# Altium schematic sheet Smart_Lighting_System_P1.SchDoc
size A; SheetNumber: 2; SheetTotal: 2
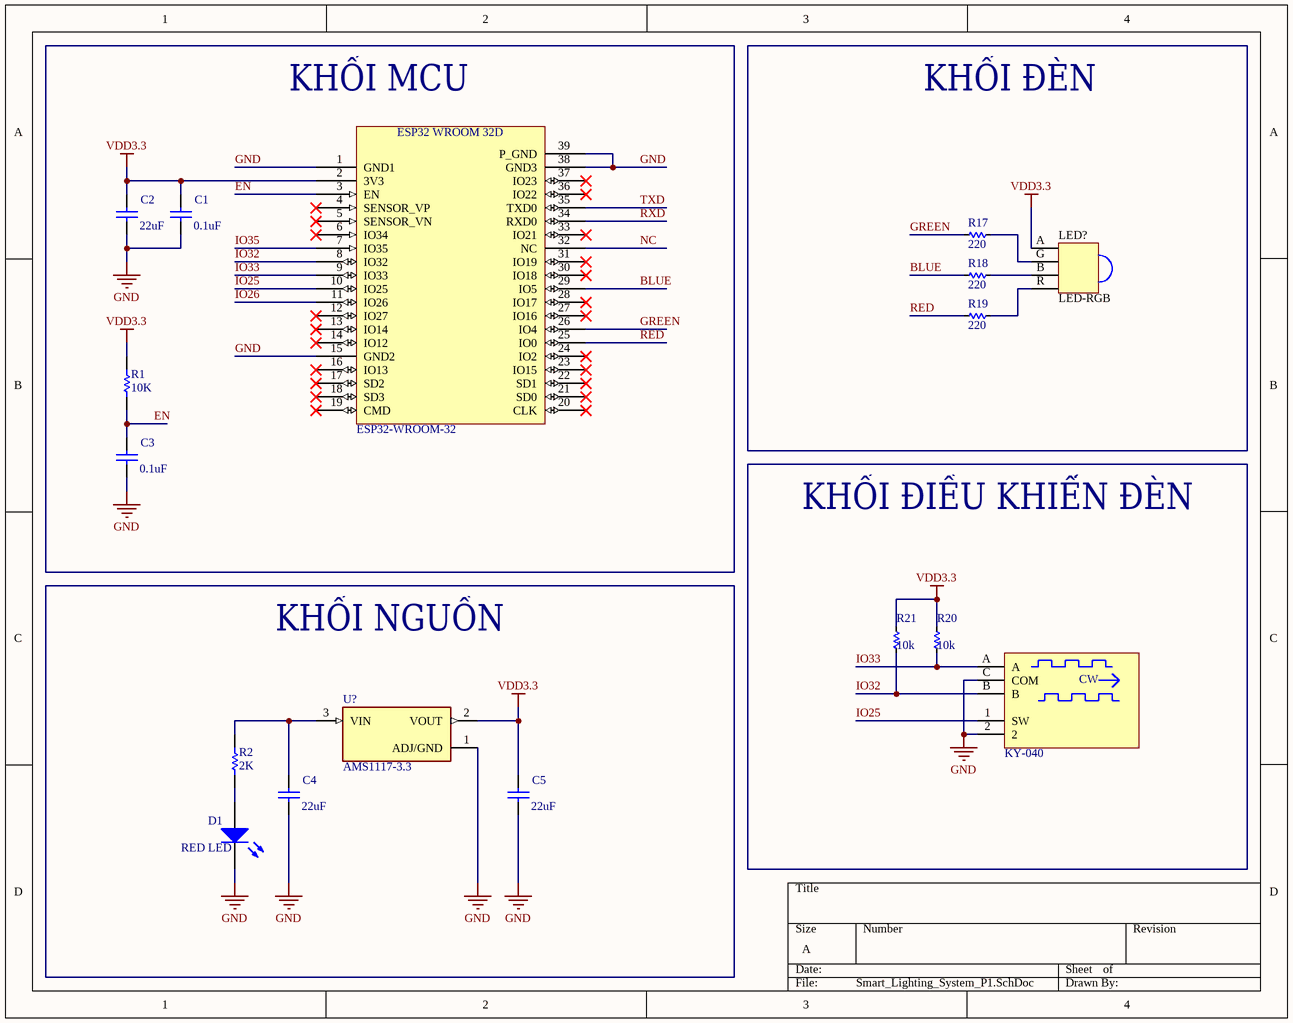
[diagram p0: Smart_Lighting_System_P1.SchDoc]

## Parts
C1  value 0.1uF  (hidden comment: Capacitor)
C2  value 22uF  (hidden comment: Capacitor)
C3  value 0.1uF  (hidden comment: Capacitor)
C4  value 22uF  (hidden comment: Capacitor)
C5  value 22uF  (hidden comment: Capacitor)
D1  RED LED
ESP32  ESP32-WROOM-32
KY-040  482020514001  [4820xx514001]  (value not drawn)
LED?  LED-RGB  [LED-5MMRGBCA]
R1  value 10K  (hidden comment: Resistor)
R2  value 2K  (hidden comment: Resistor)
R17  220  [RES-SMD-0805]
R18  220  [RES-SMD-0805]
R19  220  [RES-SMD-0805]
R20  10k  [RES-SMD-0805]
R21  10k  [RES-SMD-0805]
U?  AMS1117-3.3  [SOT229P700X180-4N]

## Nets
GND: C1.1 C2.1 C3.1 C4.1 C5.1 D1.2(K) ESP32.1(GND1) ESP32.15(GND2) ESP32.38(GND3) ESP32.39(P_GND) KY-040.2 KY-040.C(COM) U?.1(ADJ/GND)
VDD3.3: C1.2 C2.2 C5.2 ESP32.2(3V3) LED?.A R1.2 R20.1 R21.1 U?.2(VOUT)
BLUE: ESP32.29(IO5) R18.1
EN: C3.2 ESP32.3(EN) R1.1
GREEN: ESP32.26(IO4) R17.1
IO25: ESP32.10(IO25) KY-040.1(SW)
IO26: ESP32.11(IO26)
IO32: ESP32.8(IO32) KY-040.B R21.2
IO33: ESP32.9(IO33) KY-040.A R20.2
IO35: ESP32.7(IO35)
NC: ESP32.32(NC)
RED: ESP32.25(IO0) R19.1
RXD: ESP32.34(RXD0)
TXD: ESP32.35(TXD0)
NetC4_2: C4.2 R2.2 U?.3(VIN)
NetD1_1: D1.1(A) R2.1
NetLED?_B: LED?.B R18.2
NetLED?_G: LED?.G R17.2
NetLED?_R: LED?.R R19.2

Not connected (* = marked no-connect by the designer): ESP32 4(SENSOR_VP)* 5(SENSOR_VN)* 6(IO34)* 12(IO27)* 13(IO14)* 14(IO12)* 16(IO13)* 17(SD2)* 18(SD3)* 19(CMD)* 20(CLK)* 21(SD0)* 22(SD1)* 23(IO15)* 24(IO2)* 27(IO16)* 28(IO17)* 30(IO18)* 31(IO19)* 33(IO21)* 36(IO22)* 37(IO23)*

## Notes on the sheet
- KHỐI MCU
- KHỐI ĐÈN
- KHỐI ĐIỀU KHIỂN ĐÈN
- KHỐI NGUỒN
- (in symbol 482020514001) CW
- (in symbol Component_1) ESP32 WROOM 32D

## Library data of the parts
C1-C5 = Capacitor: SimulationGenericComponent: True
D1 = LED: Light-Emitting Diode; AF: 1; BV: 0; BV_MAX: 1e99; EG: 1.11; FC: 0.5; IBV: 0.001; IS: 1e-14; MJSW: 0.33; NTUN: 30; TNOM: 27; XTI: 3; SimulationGenericComponent: True; CJO: 0; CJP: 0; CTA: 0; CTP: 0; FCS: 0.5; FV_MAX: 1e99; IKF: 0; IKR: 0; ISR: 1e-14; JSW: 0; JTUN: 0; JTUNSW: 0; KEG: 1; KF: 0; LEVEL: 1; N: 1; NBV: 1; NR: 1; NS: 1; PHP: 1; RS: 0; TCV: 0; TLEV: 0; TLEVC: 0; TM1: 0; TM2: 0; TPB: 0; TPHP: 0; TRS: 0; TRS2: 0; TT: 0; TTT1: 0; TTT2: 0; VJ: 1; XTITUN: 3
ESP32 = Component_1
KY-040 = 482020514001: WS-ENTV Mechanical Incremental Encoder Switch, Metal Shaft with bushing, 20Pulse/360°, 20positions,; Manufacturer: Wurth Elektronik; Operation Force: 600g; Electrical Life Encoder: 15000Cycles; Electrical Life Switch: 20000Cycles; Insulation Resistance: 100MΩ; Rated Current: 10mA; ComponentLink1Description: Website Link; ComponentLink1URL: https://www.we-online.com/redexpert/article/482020514001?ad; ComponentLink2Description: Datasheet Link; ComponentLink2URL: https://www.we-online.com/redexpert/spec/482020514001?ad; Manufacturer Part Number: 482020514001; Category: Encoder Switches; Match Code: WS-ENTV; Mount: Through Hole; Operating Temperature Max: 85°C; Operating Temperature Min: -40°C; Packaging: Tray; Length: 13.75mm; Width: 11.7mm; Height: 26.6mm; Detent: 20positions; Resolution: 20Pulse/360°
R1 R2 = Resistor: TC1: 0; SimulationGenericComponent: True; TC2: 0
R17-R21 = Res-SMD: Resistor; Manufacturer: Generic Components; Class: Passive; Published: 08/06/2000; Publisher: Altium Hobart Technology Centre
U? = AMS1117-3.3: Linear Voltage Regulator IC Positive Fixed 1 Output 1A SOT-223-3L; MF: UMW; SnapEDA_Link: https://www.snapeda.com/parts/AMS1117-3.3/UMW/view-part/?ref=snap; Package: SOT-223-3L UMW; Value: *; MP: AMS1117-3.3; Check_prices: https://www.snapeda.com/parts/AMS1117-3.3/UMW/view-part/?ref=eda